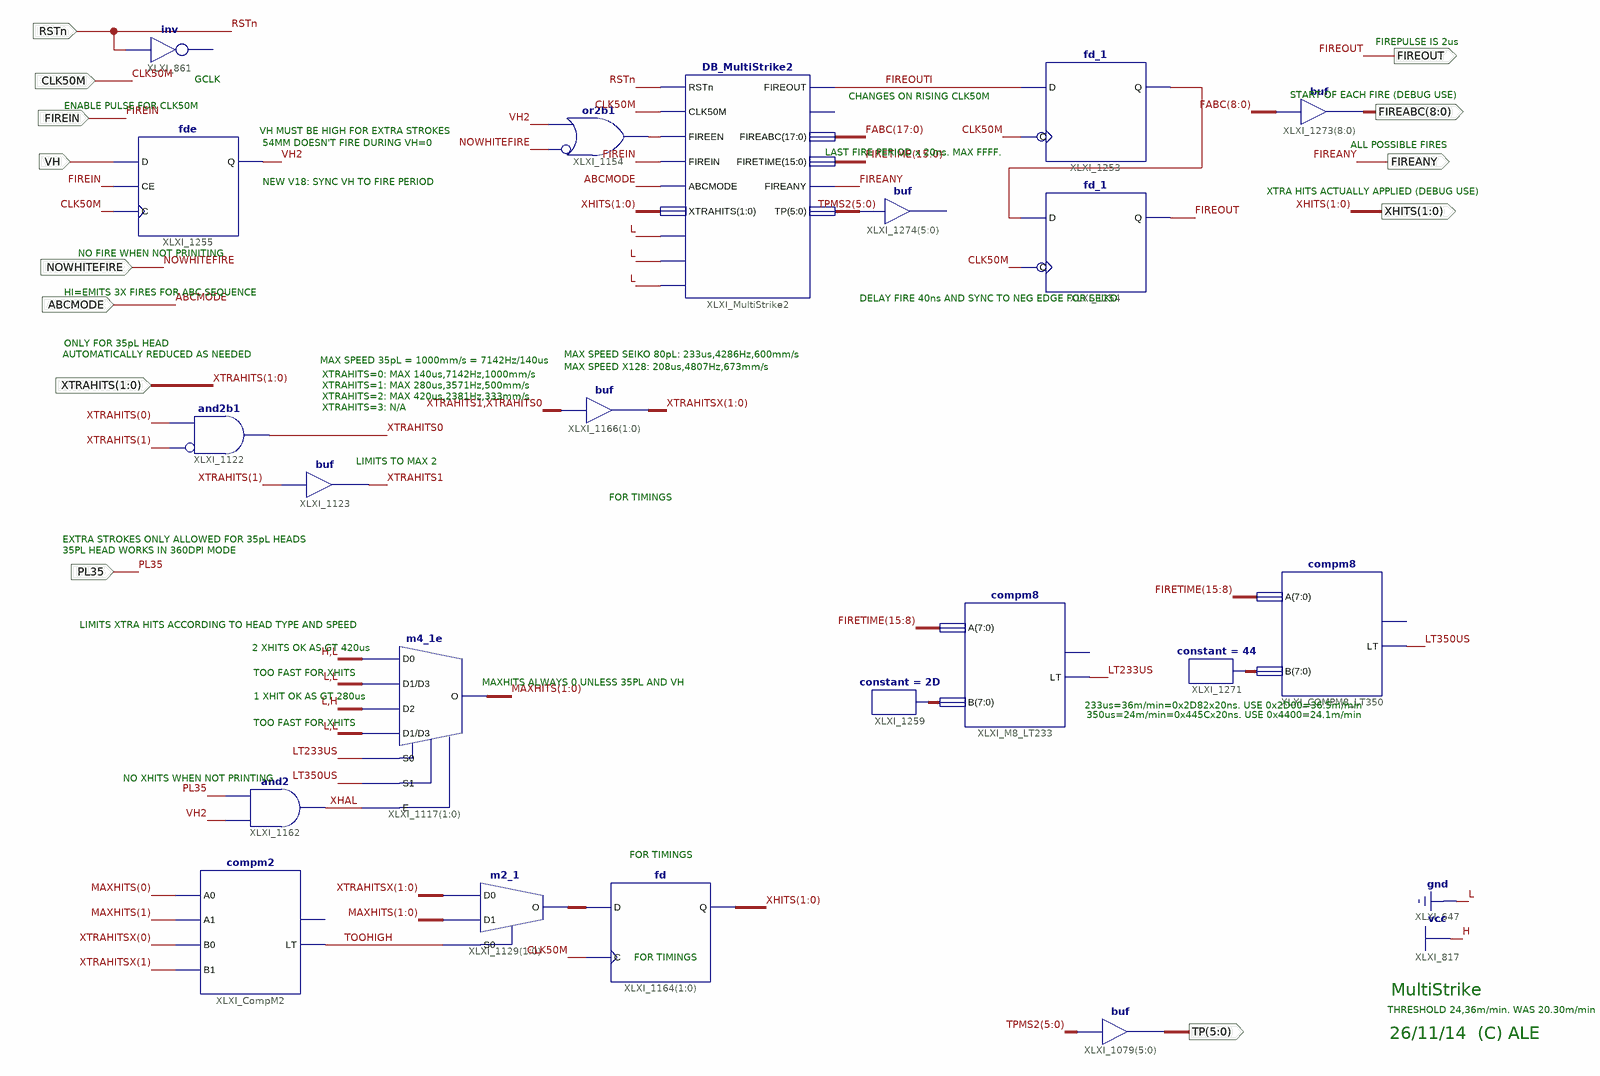
[diagram p0: schematic sheet 1]
// Xilinx ISE schematic DB_MultiStrike.sch (spartan3e) as structural Verilog: 21 symbols, 13 ports
module DB_MultiStrike (
  input  RSTn,
  input  FIREIN,
  input  CLK50M,
  input  ABCMODE,
  input  VH,
  input  [1:0] XTRAHITS,
  input  NOWHITEFIRE,
  input  PL35,
  output FIREOUT,
  output [8:0] FIREABC,
  output [1:0] XHITS,
  output [5:0] TP,
  output FIREANY
);

  wire FIREOUTI, LT233US, LT350US, TOOHIGH, VH2, XHAL, XLXN_816, XLXN_1086, XTRAHITS0, XTRAHITS1;
  wire [1:0] MAXHITS, XLXN_1084, XTRAHITSX;
  wire [5:0] TPMS2;
  wire [7:0] XLXN_1103, XLXN_1134;
  wire [15:0] FIRETIME;
  wire [17:0] FABC;

  and XLXI_1122 (XTRAHITS0, ~XTRAHITS[1], XTRAHITS[0]);  // and2b1
  buf XLXI_1123 (XTRAHITS1, XTRAHITS[1]);
  assign XTRAHITSX = {XTRAHITS1, XTRAHITS0};  // buf XLXI_1166[1..0], 2 bits wide
  m4_1e XLXI_1117[1:0] (
    .D0(2'b10), .D1(2'b00), .D2(2'b01), .D3(2'b00), .E(XHAL), .S0(LT233US), .S1(LT350US), .O(MAXHITS));
  compm2 XLXI_CompM2 (
    .A0(MAXHITS[0]), .A1(MAXHITS[1]), .B0(XTRAHITSX[0]), .B1(XTRAHITSX[1]), .LT(TOOHIGH));  // open: GT
  m2_1 XLXI_1129[1:0] (.D0(XTRAHITSX), .D1(MAXHITS), .S0(TOOHIGH), .O(XLXN_1084));
  and XLXI_1162 (XHAL, VH2, PL35);
  fd XLXI_1164[1:0] (.C(CLK50M), .D(XLXN_1084), .Q(XHITS));
  assign TP = TPMS2;  // buf XLXI_1079[5..0], 6 bits wide
  or XLXI_1154 (XLXN_816, ~NOWHITEFIRE, VH2);  // or2b1
  fd_1 XLXI_1254 (.C(CLK50M), .D(XLXN_1086), .Q(FIREOUT));
  fd_1 XLXI_1253 (.C(CLK50M), .D(FIREOUTI), .Q(XLXN_1086));
  // inv XLXI_861 has open pins: I=RSTn, O=open
  fde XLXI_1255 (.C(CLK50M), .CE(FIREIN), .D(VH), .Q(VH2));
  constant #(.CValue("2D")) XLXI_1259 (.O(XLXN_1103));
  compm8 XLXI_M8_LT233 (.A(FIRETIME[15:8]), .B(XLXN_1103), .LT(LT233US));  // open: GT
  constant #(.CValue("44")) XLXI_1271 (.O(XLXN_1134));
  compm8 XLXI_COMPM8_LT350 (.A(FIRETIME[15:8]), .B(XLXN_1134), .LT(LT350US));  // open: GT
  assign FIREABC = FABC[8:0];  // buf XLXI_1273[8..0], 9 bits wide
  DB_MultiStrike2 XLXI_MultiStrike2 (
    .ABCMODE(ABCMODE), .CLK50M(CLK50M), .DPI360(1'b0), .FIREABC(FABC), .FIREANY(FIREANY), .FIREEN(XLXN_816),
    .FIREIN(FIREIN), .FIREOUT(FIREOUTI), .FIRETIME(FIRETIME), .ISTOSH(1'b0), .RSTn(RSTn), .TOSHD150(1'b0),
    .TP(TPMS2), .XTRAHITS(XHITS));  // open: ACTIVE
  // buf XLXI_1274[5..0] has open pins: I=TPMS2, O=open

  // Notes on the sheet:
  //   FIREPULSE IS 2us
  //   GCLK
  //   START OF EACH FIRE (DEBUG USE)
  //   CHANGES ON RISING CLK50M
  //   ENABLE PULSE FOR CLK50M
  //   VH MUST BE HIGH FOR EXTRA STROKES
  //   54MM DOESN'T FIRE DURING VH=0
  //   ALL POSSIBLE FIRES
  //   LAST FIRE PERIOD x 20ns. MAX FFFF.
  //   NEW V18: SYNC VH TO FIRE PERIOD
  //   XTRA HITS ACTUALLY APPLIED (DEBUG USE)
  //   NO FIRE WHEN NOT PRINITING
  //   HI=EMITS 3X FIRES FOR ABC SEQUENCE
  //   DELAY FIRE 40ns AND SYNC TO NEG EDGE FOR SEIKO
  //   ONLY FOR 35pL HEAD
  //   AUTOMATICALLY REDUCED AS NEEDED
  //   MAX SPEED SEIKO 80pL: 233us,4286Hz,600mm/s
  //   MAX SPEED 35pL = 1000mm/s = 7142Hz/140us
  //   MAX SPEED X128: 208us,4807Hz,673mm/s
  //   XTRAHITS=0: MAX 140us,7142Hz,1000mm/s
  //   XTRAHITS=1: MAX 280us,3571Hz,500mm/s
  //   XTRAHITS=2: MAX 420us,2381Hz,333mm/s
  //   XTRAHITS=3: N/A
  //   LIMITS TO MAX 2
  //   FOR TIMINGS
  //   EXTRA STROKES ONLY ALLOWED FOR 35pL HEADS
  //   35PL HEAD WORKS IN 360DPI MODE
  //   LIMITS XTRA HITS ACCORDING TO HEAD TYPE AND SPEED
  //   2 XHITS OK AS GT 420us
  //   TOO FAST FOR XHITS
  //   MAXHITS ALWAYS 0 UNLESS 35PL AND VH
  //   1 XHIT OK AS GT 280us
  //   233us=36m/min=0x2D82x20ns. USE 0x2D00=36.5m/min
  //   350us=24m/min=0x445Cx20ns. USE 0x4400=24.1m/min
  //   TOO FAST FOR XHITS
  //   NO XHITS WHEN NOT PRINTING
  //   FOR TIMINGS
  //   FOR TIMINGS
  //   MultiStrike
  //   THRESHOLD 24,36m/min. WAS 20.30m/min
  //   26/11/14  (C) ALE
endmodule
